# Altium schematic sheet Panel.SchDoc
size A3
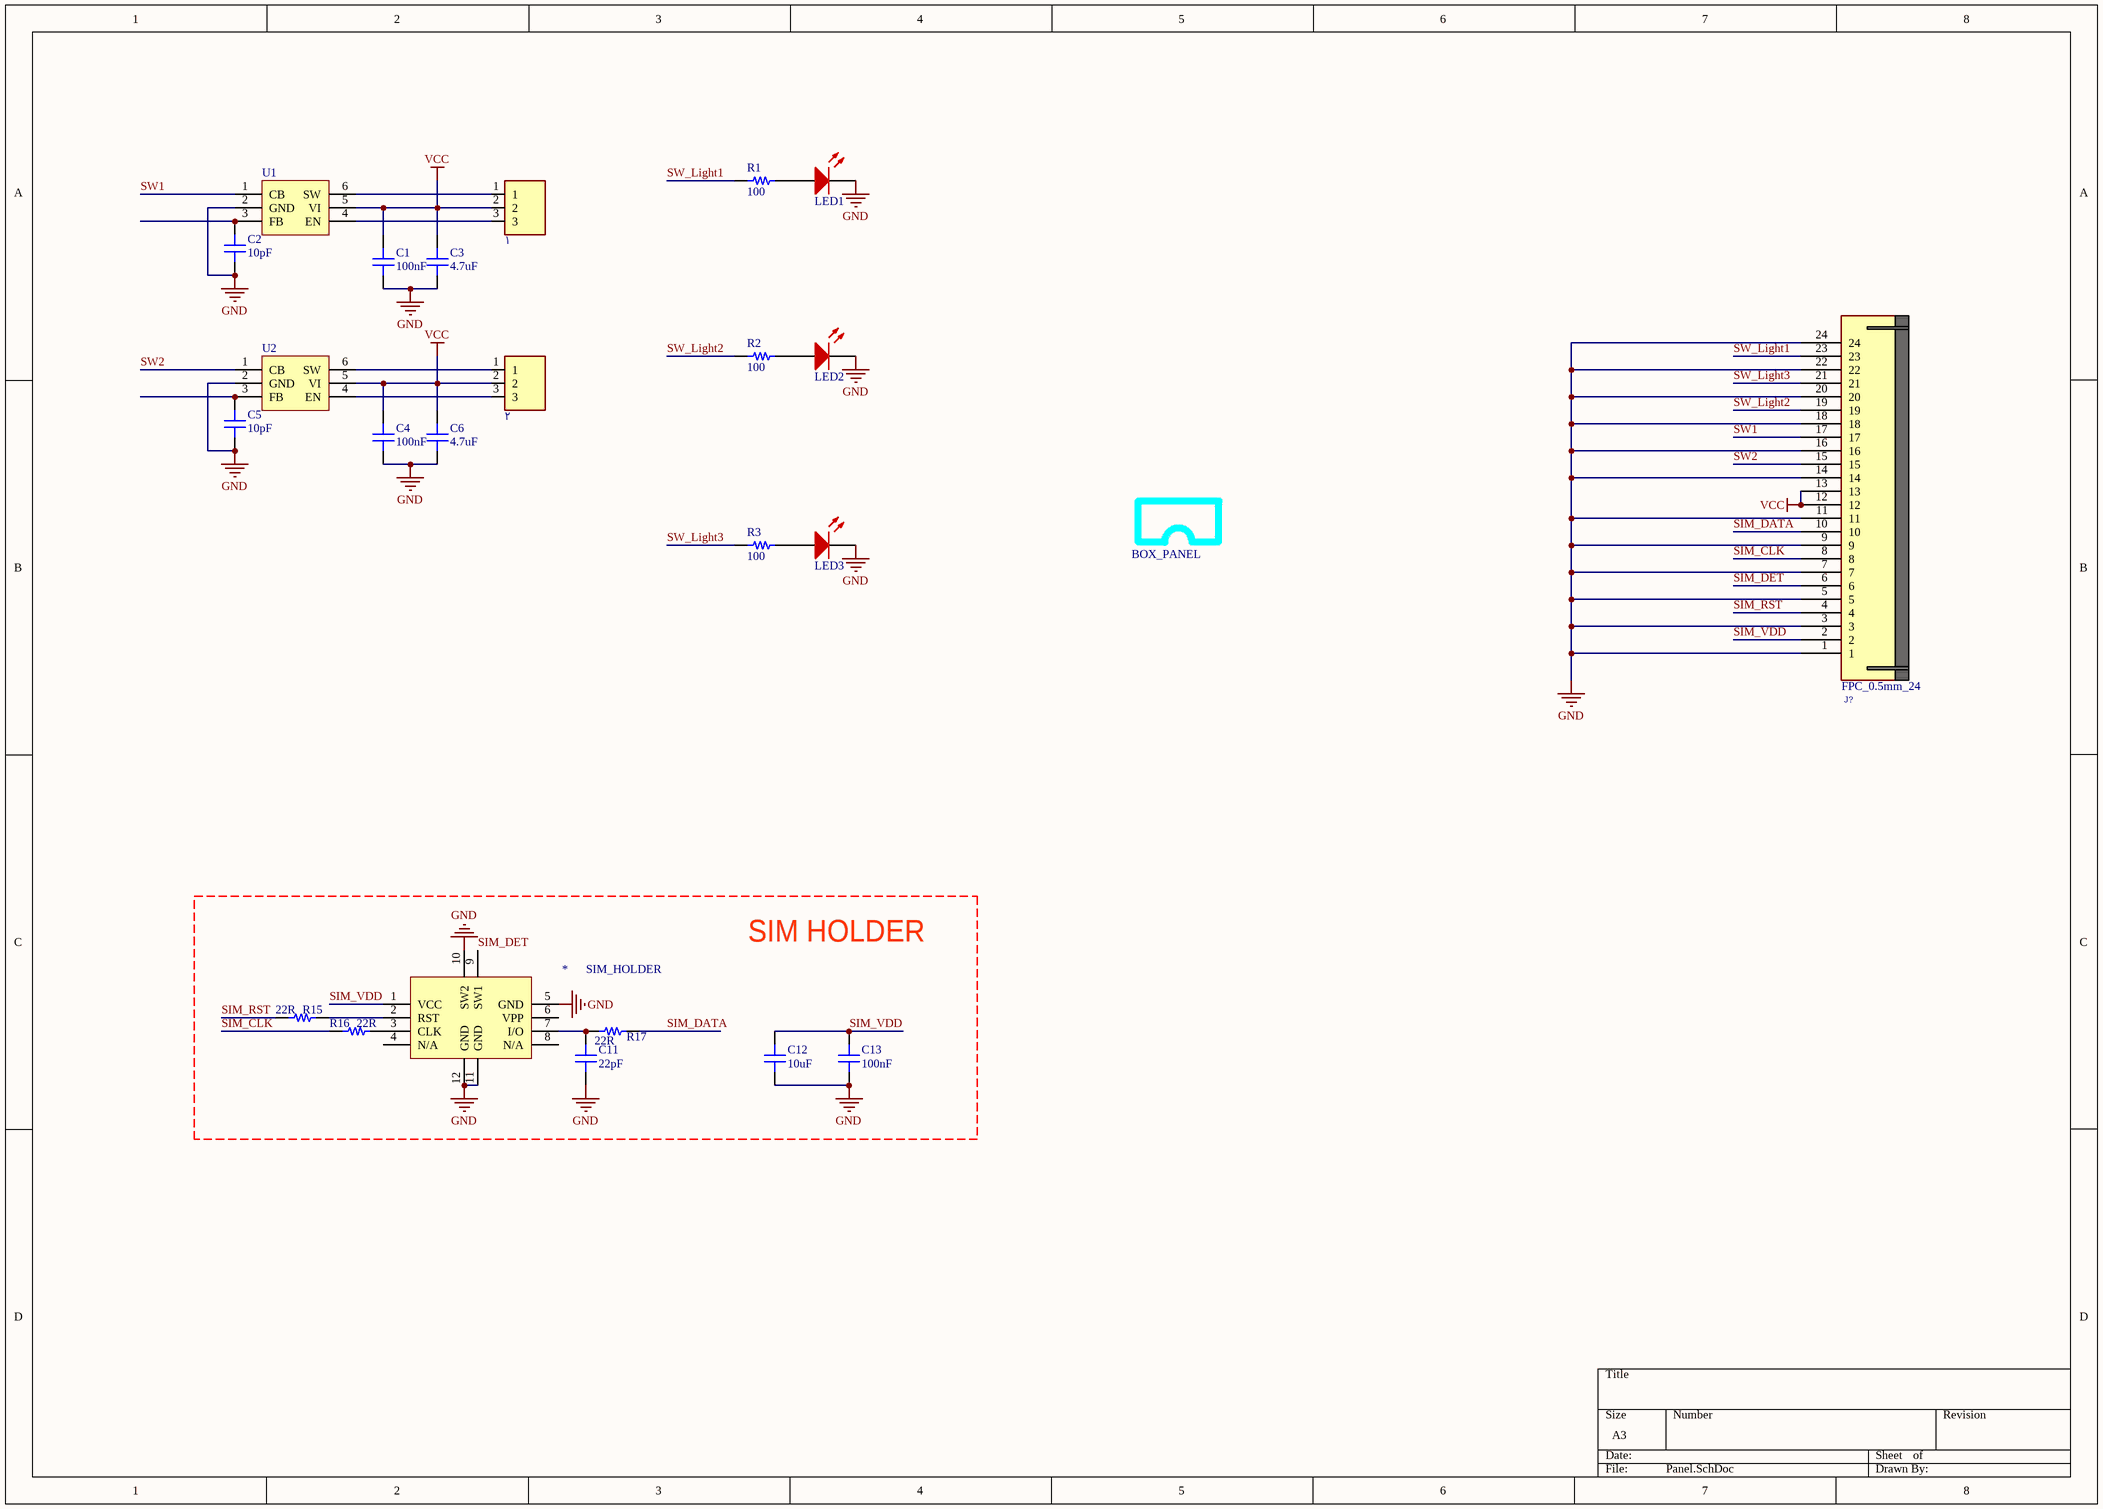
[diagram p0: Panel.SchDoc]

## Parts
۱  CONN_PWL_3  [SOLDER 3Pin SELECTOR]  (value not drawn)
۲  CONN_PWL_3  [SOLDER 3Pin SELECTOR]  (value not drawn)
*  SIM_HOLDER  [SIM_Holder]
BOX_PANEL  BOX_PANEL  [BOX_PANEL_S]  (value not drawn)
C1  100nF  [CAP 0805]
C2  10pF  [CAP 0805]
C3  4.7uF  [CAP 0805]
C4  100nF  [CAP 0805]
C5  10pF  [CAP 0805]
C6  4.7uF  [CAP 0805]
C11  22pF  [CAP 0603_1608]
C12  10uF  [CAP 0603_1608]
C13  100nF  [CAP 0603_1608]
J?  FPC_0.5mm_24  [FPC50_24]
LED1  LED SMD 1206 RED  [LED_1206_BLUE]  (value not drawn)
LED2  LED SMD 1206 RED  [LED_1206_BLUE]  (value not drawn)
LED3  LED SMD 1206 RED  [LED_1206_BLUE]  (value not drawn)
R1  100  [RES 0805]
R2  100  [RES 0805]
R3  100  [RES 0805_2012]
R15  22R  [RES 0603_1608]
R16  22R  [RES 0603_1608]
R17  22R  [RES 0603_1608]
U1  HT7463  [SOT23-6]  (value not drawn)
U2  HT7463  [SOT23-6]  (value not drawn)

## Nets
GND: *.5(GND) *.10(SW2) *.11(GND) *.12(GND) C1.2 C2.2 C3.2 C4.2 C5.2 C6.2 C11.1 C12.1 C13.1 J?.1 J?.3 J?.5 J?.7 J?.9 J?.11 J?.14 J?.16 J?.18 J?.20 J?.22 J?.24 LED1.2(K) LED2.2(K) LED3.2(K) U1.2(GND) U2.2(GND)
VCC: ۱.2 ۲.2 C1.1 C3.1 C4.1 C6.1 J?.12 J?.13 U1.5(VI) U2.5(VI)
SIM_CLK: J?.8 R16.1
SIM_DATA: J?.10 R17.2
SIM_DET: *.9(SW1) J?.6
SIM_RST: J?.4 R15.1
SIM_VDD: *.1(VCC) C12.2 C13.2 J?.2
SW1: J?.17 U1.1(CB)
SW2: J?.15 U2.1(CB)
SW_Light1: J?.23 R1.1
SW_Light2: J?.19 R2.1
SW_Light3: J?.21 R3.1
Net*_2: *.2(RST) R15.2
Net*_3: *.3(CLK) R16.2
Net*_7: *.7(I/O) C11.2 R17.1
NetC2_1: C2.1 U1.3(FB)
NetC5_1: C5.1 U2.3(FB)
NetLED1_1: LED1.1(A) R1.2
NetLED2_1: LED2.1(A) R2.2
NetLED3_1: LED3.1(A) R3.2
Net۱_1: ۱.1 U1.6(SW)
Net۱_3: ۱.3 U1.4(EN)
Net۲_1: ۲.1 U2.6(SW)
Net۲_3: ۲.3 U2.4(EN)

Not connected (* = marked no-connect by the designer): * 4(N/A) 6(VPP) 8(N/A)

## Notes on the sheet
- SIM HOLDER

## Library data of the parts
۱ ۲ = Solder 3Pin Selector: VALUE: CONN_PWL_3
C1-C6 = Cap SMD 0805: SMT Capacitor
  C1 C4: Value: 100nF
  C2 C5: Value: 10pF
  C3 C6: Value: 4.7uF
C11-C13 = Cap 0603: SMT Capacitor
  C11: VALUE: 22pF
  C12: VALUE: 10uF
  C13: VALUE: 100nF
J? = FPC50_24: CONN, FPC, 0.50mm pitch, RightAngle, Bot. Contact; DESC: FH12F-24S-0.5SH(55); MANF: MOLEX, Hirose, FCI; MANF_P#: 52437-2433, FH12-24S-0.5SH(55), SFV24R-1ST; VALUE: FPC_0.5mm_24
R1-R3 = Res SMD 0805: SMD Resistor; Value: 100
R15-R17 = Res 0603: SMT Resistor; VALUE: 22R